# EAGLE schematic LED Strip driver (EAGLE 9.1.3)
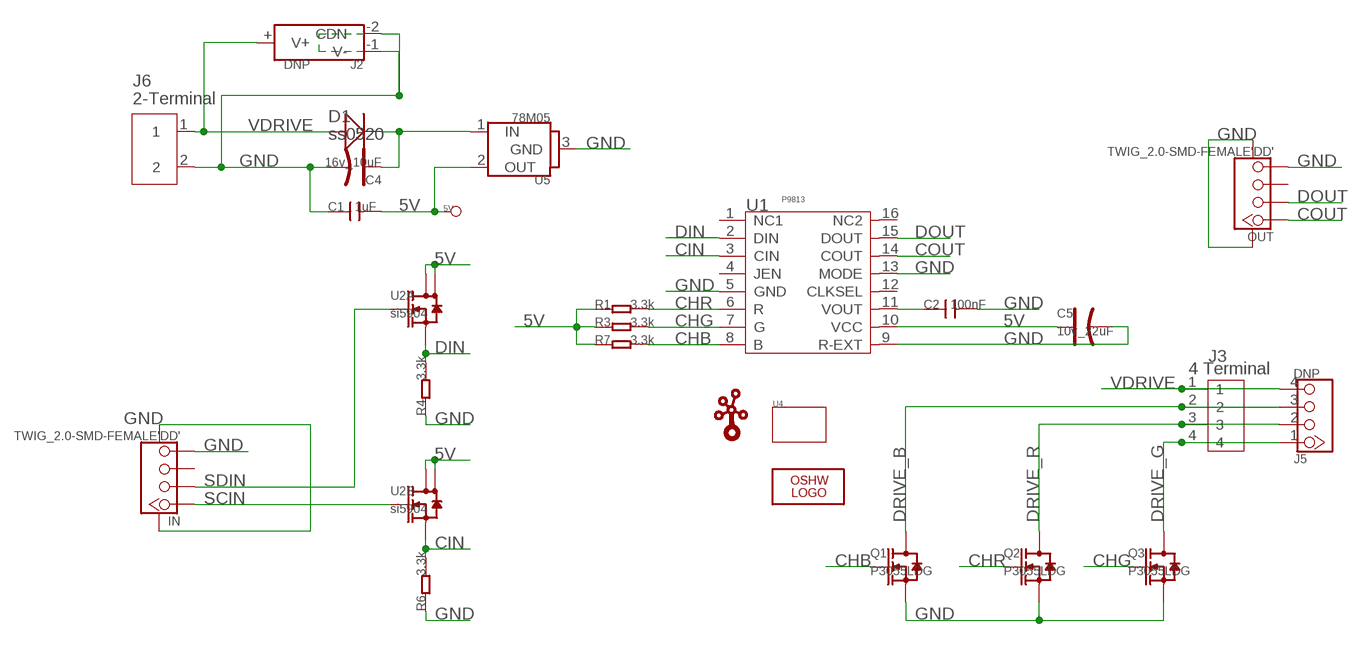
[diagram p0: schematic, sheet 1]

## Parts
5V  DNP  PAD-TEST-POINT-CIRCLE_SIZE_3030  [TP_3535]
C1  1uF  C-0805  [0805]
C2  100nF  C-0402  [0402]
C4  16v_10uF  CAP-AVX-A  [AVX-A]
C5  10v_22uF  CAP-AVX-A  [AVX-A]
D1  ss0520  D'1206'  [SOD123]
IN  TWIG_2.0-SMD-FEMALE'DD'  [2.0_1X4DD]
J2  DNP  JACK-3P-2.5MM-2.5MM  [PW-3P-2.5]
J3  4 Terminal  SCREW-TERMINAL-4P'2.54'  [4P-2.54-15.6X12.2X13.2]
J5  DNP  HEADER-4P-90D  [4P-2.54-90]
J6  2-Terminal  SCREW-TERMINAL-2P'2.54'  [2P-2.54-12.1X8.5X13.4]
LOGO1  LOGO-OSHW-FILLX0200-NT  [OSHW_FILLX200_NOTEXT]
OUT  TWIG_2.0-SMD-FEMALE'DD'  [2.0_1X4DD]
Q1  P3055LDG  MOSFET-N-P3055LDG  [TO252]
Q2  P3055LDG  MOSFET-N-P3055LDG  [TO252]
Q3  P3055LDG  MOSFET-N-P3055LDG  [TO252]
R1  3.3k  R-0402  [0402]
R3  3.3k  R-0402  [0402]
R4  3.3k  R-0402  [0402]
R6  3.3k  R-0402  [0402]
R7  3.3k  R-0402  [0402]
U1  P9813  P9813-SSOP16  [SSOP16]
U2  si5904  MOSFET-DUAL-N-1206-8  [1206-8]
U4  TWIG3U-W/O-DRILL  [3U-DIM-W/O-DRILL]
U5  78M05  78M05-TO252  [TO252]
U$1  LOGO-TWIG  [TWIGLOGO]

## Nets
5V: 5V.T C1.2 C5.+ R1.1 R3.1 R7.1 U1.10(VCC) U2.5(B:D) U2.6(B:D) U2.7(A:D) U2.8(A:D) U5.2(OUT)
CHB: Q1.1(G) R7.2 U1.8(B)
CHG: Q3.1(G) R3.2 U1.7(G)
CHR: Q2.1(G) R1.2 U1.6(R)
CIN: R6.2 U1.3(CIN) U2.3(B:S)
COUT: OUT.1 U1.14(COUT)
DIN: R4.2 U1.2(DIN) U2.1(A:S)
DOUT: OUT.2 U1.15(DOUT)
DRIVE_B: J3.2 J5.3 Q1.2(D)
DRIVE_G: J3.4 J5.1 Q3.2(D)
DRIVE_R: J3.3 J5.2 Q2.2(D)
GND: C1.1 C2.2 C4.- C5.- IN.4 IN.SS1 IN.SS2 J2.-1(V-) J2.-2(CDN) J6.2 OUT.4 OUT.SS1 OUT.SS2 Q1.3(S) Q2.3(S) Q3.3(S) R4.1 R6.1 U1.5(GND) U1.9(R-EXT) U1.13(MODE) U5.3(GND)
N$1: C2.1 U1.11(VOUT)
N$2: C4.+ D1.- U5.1(IN)
SCIN: IN.1 U2.4(B:G)
SDIN: IN.2 U2.2(A:G)
VDRIVE: D1.+ J2.+(V+) J3.1 J5.4 J6.1
Unconnected: IN.3 OUT.3 U1.1(NC1) U1.4(JEN) U1.12(CLKSEL) U1.16(NC2)

## Library data of the parts
5V = Discrete:PAD-TEST-POINT-CIRCLE
C1 C2 = Discrete:C*: Ceramic Capacitors
C4 C5 = Discrete:CAP*: Electrolytic Capacitors,Tantalum Capacitors and Super Capacitors
D1 = Discrete:D*
IN OUT = Connector:TWIG_2.0-SMD-FEMALE
J2 = Connector:JACK-3P-2.5MM
J3 = Connector:SCREW-TERMINAL-4P
J5 = Connector:HEADER-4P
J6 = Connector:SCREW-TERMINAL-2P
LOGO1 = Logo:LOGO-OSHW-FILL
Q1-Q3 = Discrete:MOSFET-N: IRLL014: http://www.vishay.com/docs/91319/sihll014.pdf
R1 R3 R4 R6 R7 = Discrete:R*
U1 = IC:P9813-SSOP16
U2 = Discrete:MOSFET-DUAL-N: Si5902BDC/Si5904DC/Si5908DC/Si5920DC
U4 = Module:TWIG
U5 = IC:78M05: 0.5A Three Terminal Positive Voltage Regulators http://pdf1.alldatasheet.com/datasheet-pdf/view/31368/TOSHIBA/78M05/+21_79UPLRhpDDdCDytD+/datasheet.pdf
U$1 = Logo:LOGO-TWIG